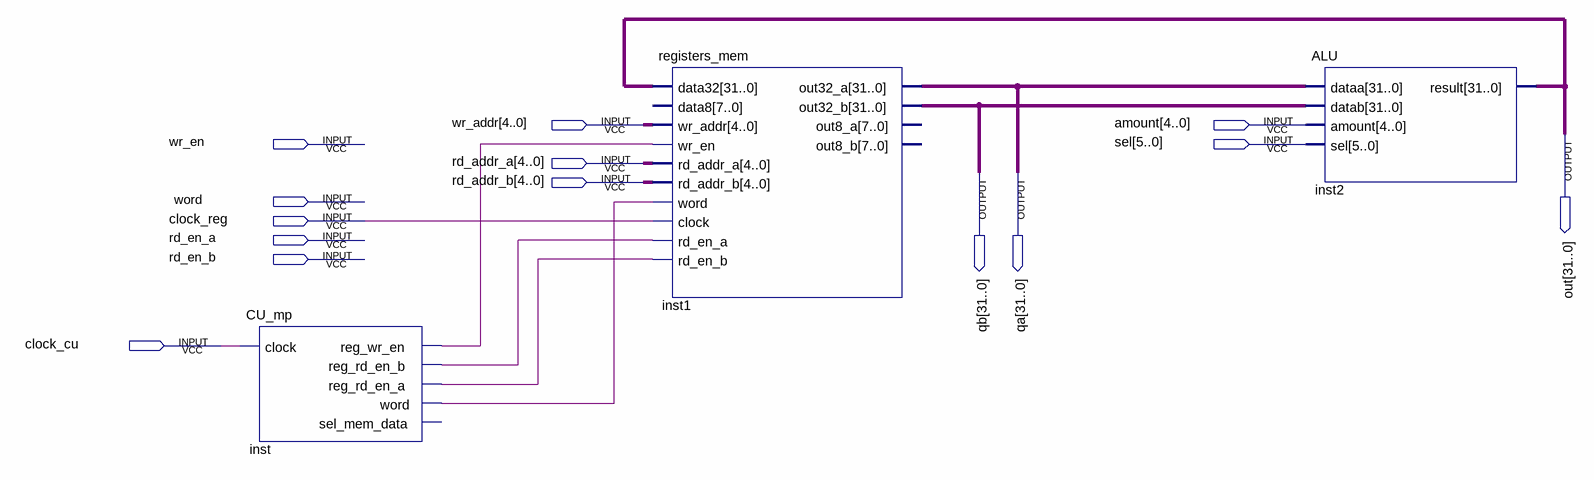
[diagram p0: schematic sheet]
// Quartus schematic test_reg_mem.bdf as structural Verilog: 3 symbols, 14 pins
module test_reg_mem (
  input  [4:0] wr_addr,
  input  [4:0] amount,
  input  wr_en,
  input  [5:0] sel,
  input  [4:0] rd_addr_a,
  input  [4:0] rd_addr_b,
  input  word,
  input  clock_reg,
  input  rd_en_a,
  input  rd_en_b,
  input  clock_cu,
  output [31:0] out,
  output [31:0] qb,
  output [31:0] qa
);

  wire inst_reg_rd_en_a, inst_reg_rd_en_b, inst_reg_wr_en, inst_word;

  CU_mp inst (
    .clock(clock_cu), .reg_wr_en(inst_reg_wr_en), .reg_rd_en_b(inst_reg_rd_en_b),
    .reg_rd_en_a(inst_reg_rd_en_a), .word(inst_word));  // open: sel_mem_data
  registers_mem inst1 (
    .data32(out), .wr_addr(wr_addr), .wr_en(inst_reg_wr_en), .rd_addr_a(rd_addr_a), .rd_addr_b(rd_addr_b),
    .word(inst_word), .clock(clock_reg), .rd_en_a(inst_reg_rd_en_b), .rd_en_b(inst_reg_rd_en_a),
    .out32_a(qa), .out32_b(qb));  // open: data8, out8_a, out8_b
  ALU inst2 (.dataa(qa), .datab(qb), .amount(amount), .sel(sel), .result(out));
endmodule
